# Altium project PCB_Project.PrjPcb
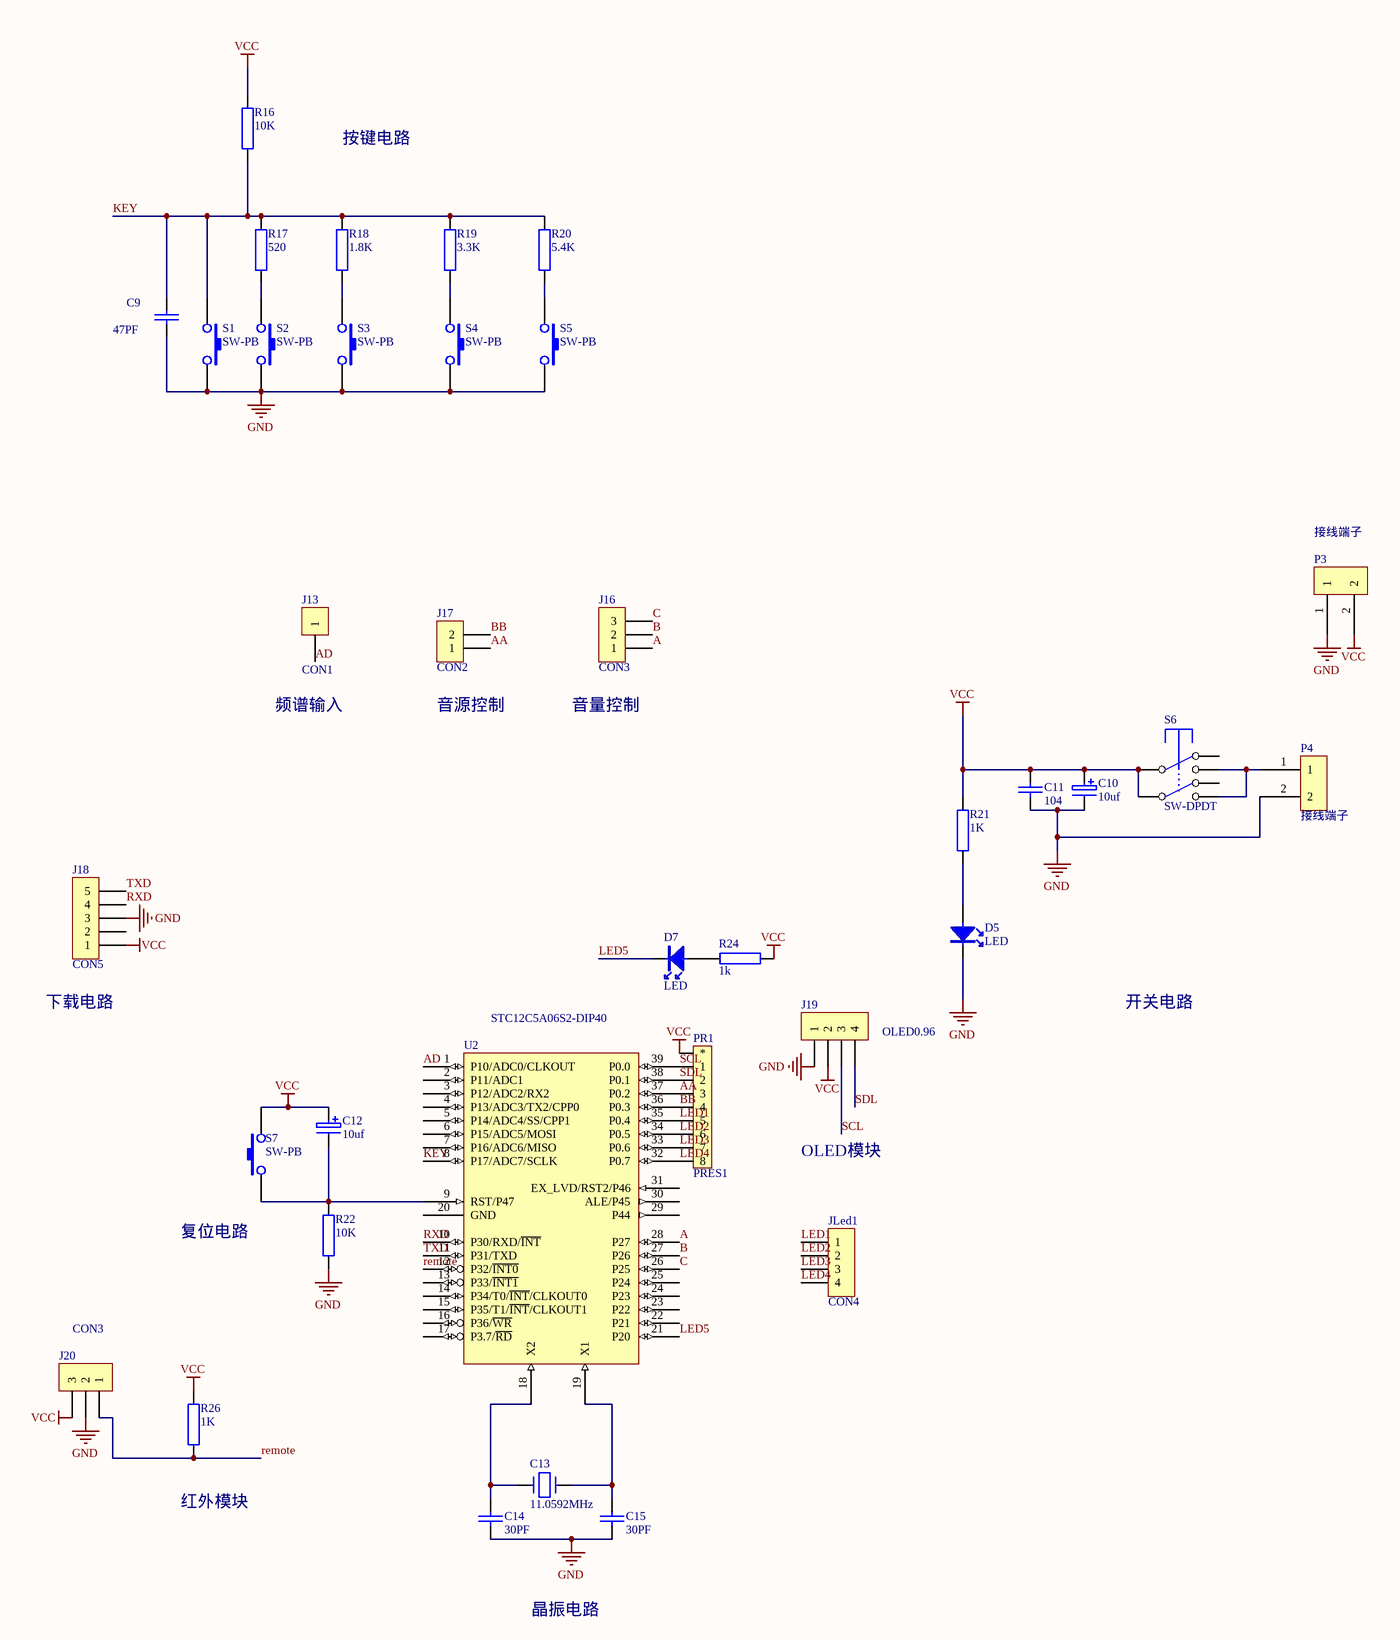
[diagram p0: Sheet1.SchDoc]
1 sheet, 36 parts. Net scope: global (net labels, ports and power ports of the same name join across sheets).
Board file: PCB1.PcbDoc

## Sheet Sheet1.SchDoc
size A2

### Parts
C9  47PF  [CAP2]
C10  10uf  [CAO2]
C11  104  [CAP2]
C12  10uf  [CAO2]
C13  11.0592MHz  [XTAL1]
C14  30PF  [CAP2]
C15  30PF  [CAP2]
D5  LED  [LED2_B]
D7  LED  [LED2_B]
J13  CON1  [SIP-1]
J16  CON3  [sip-3]
J17  CON2  [sip-2]
J18  CON5  [sip-5]
J19  OLED0.96  [sip-4]
J20  CON3  [sip-3]
JLed1  CON4  [sip-4]
P3  接线端子  [接线端子]
P4  接线端子  [接线端子]
PR1  PRES1  [RP1]
R16  10K  [AXIAL0.4]
R17  520  [AXIAL0.4]
R18  1.8K  [AXIAL0.4]
R19  3.3K  [AXIAL0.4]
R20  5.4K  [AXIAL0.4]
R21  1K  [AXIAL0.4]
R22  10K  [AXIAL0.4]
R24  1k  [AXIAL0.4]
R26  1K  [AXIAL0.4]
S1  SW-PB  [SW6*6]
S2  SW-PB  [SW6*6]
S3  SW-PB  [SW6*6]
S4  SW-PB  [SW6*6]
S5  SW-PB  [SW6*6]
S6  SW-DPDT  [SWH8*8]
S7  SW-PB  [SW6*6]
U2  STC12C5A06S2-DIP40  [DIP-40]

### Nets
GND: C9.2 C10.2 C11.2 C14.2 C15.2 D5.2 J18.3 J19.1 J20.2 P3.1 P4.2 R22.1 S1.2 S2.2 S3.2 S4.2 S5.2
VCC: C10.1 C11.1 C12.1 J18.1 J19.2 J20.3 P3.2 PR1.1 R16.2 R21.2 R24.1 R26.2 S6.2 S6.5 S7.2 U2.40(VCC)
A: J16.1 U2.28(P27)
AA: J17.1 PR1.4(3) U2.37(P0.2)
AD: J13.1 U2.1(P10/ADC0/CLKOUT)
B: J16.2 U2.27(P26)
BB: J17.2 PR1.5(4) U2.36(P0.3)
C: J16.3 U2.26(P25)
KEY: C9.1 R16.1 R17.2 R18.2 R19.2 R20.2 S1.1 U2.8(P17/ADC7/SCLK)
LED1: JLed1.1 PR1.6(5) U2.35(P0.4)
LED2: JLed1.2 PR1.7(6) U2.34(P0.5)
LED3: JLed1.3 PR1.8(7) U2.33(P0.6)
LED4: JLed1.4 PR1.9(8) U2.32(P0.7)
LED5: D7.2 U2.21(P20)
remote: J20.1 R26.1 U2.12(P32/~{INT0})
RXD: J18.4 U2.10(P30/RXD/~{INT})
SCL: J19.3 PR1.2(1) U2.39(P0.0)
SDL: J19.4 PR1.3(2) U2.38(P0.1)
TXD: J18.5 U2.11(P31/TXD)
NetC12_2: C12.2 R22.2 S7.1 U2.9(RST/P47)
NetC13_1: C13.1 C14.1 U2.18(X2)
NetC13_2: C13.2 C15.1 U2.19(X1)
NetD5_1: D5.1 R21.1
NetD7_1: D7.1 R24.2
NetP4_1: P4.1 S6.3 S6.4
NetR17_1: R17.1 S2.1
NetR18_1: R18.1 S3.1
NetR19_1: R19.1 S4.1
NetR20_1: R20.1 S5.1

Not connected (* = marked no-connect by the designer): J18 2; S6 1 6; U2 2(P11/ADC1) 3(P12/ADC2/RX2) 4(P13/ADC3/TX2/CPP0) 5(P14/ADC4/SS/CPP1) 6(P15/ADC5/MOSI) 7(P16/ADC6/MISO) 13(P33/~{INT1}) 14(P34/T0/~{INT}/CLKOUT0) 15(P35/T1/~{INT}/CLKOUT1) 16(P36/~{WR}) 17(P3.7/~{RD}) 20(GND) 22(P21) 23(P22) 24(P23) 25(P24) 29(P44) 30(ALE/P45) 31(EX_LVD/RST2/P46)

### Notes on the sheet
- 按键电路
- 频谱输入
- (near J17) 音源控制
- (near J16) 音量控制
- (near J18) 下载电路
- 开关电路
- OLED模块
- 复位电路
- (near R26) 红外模块
- 晶振电路

### Library data of the parts
C9 C11 C14 C15 = CAP1
C10 C12 = CAP3
C13 = CPY
J13 = CON1: Connector
J16 J20 = CON3: Connector
J17 = CON2: Connector
J18 = CON5: Connector
J19 JLed1 = CON4: Connector
R16-R22 R24 R26 = RES: 电阻